# Altium schematic sheet ISOVDD.SchDoc
size A4; SheetNumber: 8; SheetTotal: 8
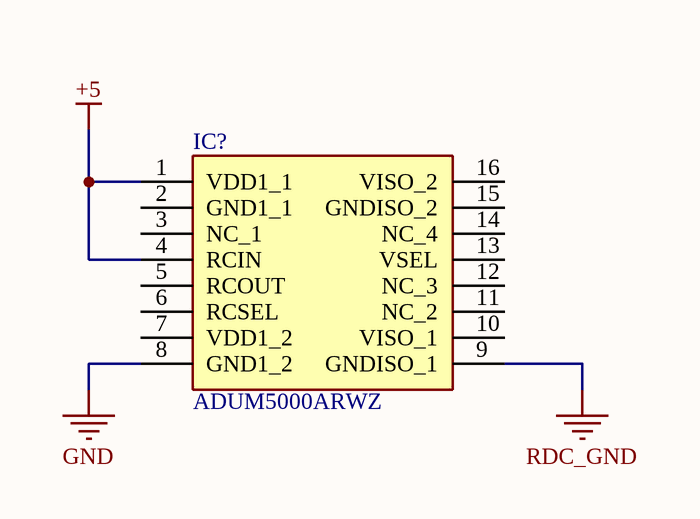
[diagram p0: ISOVDD.SchDoc]

## Parts
IC?  ADUM5000ARWZ  [SOIC127P1032X265-16N]

## Nets
+5: IC?.1(VDD1_1) IC?.4(RCIN)
GND: IC?.8(GND1_2)
RDC_GND: IC?.9(GNDISO_1)

Not connected (* = marked no-connect by the designer): IC? 2(GND1_1) 3(NC_1) 5(RCOUT) 6(RCSEL) 7(VDD1_2) 10(VISO_1) 11(NC_2) 12(NC_3) 13(VSEL) 14(NC_4) 15(GNDISO_2) 16(VISO_2)

## Library data of the parts
IC? = ADUM5000ARWZ: Integrated Circuit; Manufacturer_Name: Analog Devices; Datasheet Link: https://www.analog.com/media/en/technical-documentation/data-sheets/ADuM5000.pdf; Height: 2.65mm; Manufacturer_Part_Number: ADUM5000ARWZ; Mouser Part Number: 584-ADUM5000ARWZ; Mouser Price/Stock: https://www.mouser.co.uk/ProductDetail/Analog-Devices/ADUM5000ARWZ?qs=WIvQP4zGanhtQujw%2FAjUEw%3D%3D; Arrow Part Number: ADUM5000ARWZ; Arrow Price/Stock: https://www.arrow.com/en/products/adum5000arwz/analog-devices?region=europe